# Altium project wiring_board.PrjPcb
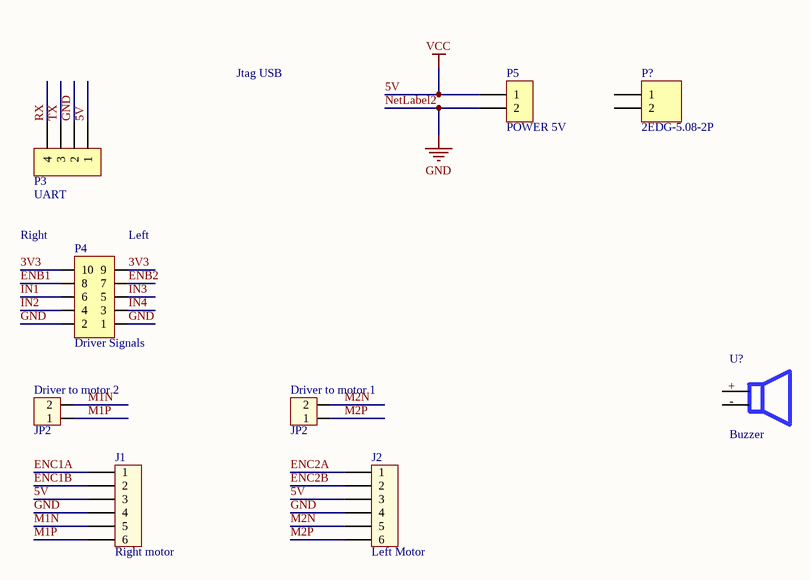
[diagram p0: wiring_board.SchDoc]
1 sheet, 9 parts. Net scope: global (net labels, ports and power ports of the same name join across sheets).
Board file: wiring_board.PcbDoc

## Sheet wiring_board.SchDoc
size A

### Parts
Driver_to_motor_1  JP2  [CON2]
Driver_to_motor_2  JP2  [CON2]
J1  Right motor  [XH 6PIN 2.54]
J2  Left Motor  [XH 6PIN 2.54]
P3  UART  [HEADER_4_MALE]
P4  Driver Signals  [HEADER_5x2_MALE_2.54]
P5  POWER 5V  [HEADER_2_MALE]
P?  2EDG-5.08-2P  [Terminal block 2Pin 5.08]
U?  Buzzer  [BUZZER D12]

### Nets
5V: J1.3 J2.3 P3.1 P5.1  [also labelled VCC]
GND: J1.4 J2.4 P3.2 P4.1 P4.2 P5.2  [also labelled NetLabel2]
3V3: P4.9 P4.10
ENB1: P4.8
ENB2: P4.7
ENC1A: J1.1
ENC1B: J1.2
ENC2A: J2.1
ENC2B: J2.2
IN1: P4.6
IN2: P4.4
IN3: P4.5
IN4: P4.3
M1N: Driver_to_motor_2.2 J1.5
M1P: Driver_to_motor_2.1 J1.6
M2N: Driver_to_motor_1.2 J2.5
M2P: Driver_to_motor_1.1 J2.6
RX: P3.4
TX: P3.3

Not connected (* = marked no-connect by the designer): P? 1 2; U? 1(+) 2(-)

### Notes on the sheet
- Jtag USB
- (near P4) Right
- (near P4) Left

### Library data of the parts
Driver_to_motor_1 Driver_to_motor_2 = Con2: Connector 2; Value: Connector 2
J1 J2 = XH_2.54_6P: 4P, 2.54mm, 250V, 3A; Manufacturer: *; Part Number: *; Package: *; Ex Supplier: *; Ex Price: *; VN Supplier: *; VN Price: *; Value: *; Tolerance: *; Voltage/Wattage: *
P3 = Header_4_Male_2.54: 2.54mm 4x1 Single Male Pin Header; Manufacturer: Molex; Ex Price: 0.34; VN Price: 2500; Value: Header 4; Voltage/Wattage: 500V/4A; Part Number: 22-28-8041; Ex Supplier: https://www.mouser.vn/ProductDetail/Molex/22-28-8041?qs=%2Fha2pyFadui70NFvRAbn%252BC%2FfLTOVR6y0%2FPOCLhktbL8%3D; VN Supplier: http://tme.vn/Product.aspx?id=518
P4 = Header_5x2_Male_2.54: 2.54mm 5x2 Male Pin Header; Manufacturer: MINTRON; Part Number: MTP125-1205S1; Ex Price: 0.053; VN Price: 1700; Voltage/Wattage: 500V/4A; Ex Supplier: https://lcsc.com/product-detail/Pin-Header-Female-Header_MINTRON-MTP125-1205S1_C358694.html; VN Supplier: https://www.thegioiic.com/products/hang-rao-duc-doi-2-54mm-80-chan-2-hang-cao-11-6mm-xuyen-lo
P5 = Header_2_Male_2.54: 2.54mm 2x1 Single Male Pin Header; Manufacturer: Molex; VN Price: 200; Value: Header 2; Voltage/Wattage: 500V/4A; Ex Price: 0.096; VN Supplier: http://www.tme.vn/Product.aspx?id=518#page=pro_info; Ex Supplier: https://www.mouser.vn/ProductDetail/Molex/22-28-5023?qs=sGAEpiMZZMs%252BGHln7q6pm0R%252BIqgWC%252BQx%252BZP1khnW%252BIc%3D; Part Number: 22-28-5023
P? = 2EDG-5.08-2P: Pluggable Terminal Blocks WR-TBL PCB Model 311 2Pin 5.08mm Cls Vtcl; Manufacturer: Wurth Elektronik; Part Number: 691311500102; Ex Price: 0.34; VN Price: 3000; Voltage/Wattage: 300V - 20A; Ex Supplier: https://www.mouser.vn/ProductDetail/Wurth-Elektronik/691311500102?qs=%2Fha2pyFaduhL3k1l8cITJNpuw5ctJaUN5kmE3D1IKhn6PrUHnsDfng%3D%3D; VN Supplier: https://thegioiic.com/products/terminal-block-2-chan-5-08-chan-thang-2edg-5-08-2p
U? = Buzzer: DIP Buzzer 12x9mm; Manufaceturer: OEM; VN Price: 3000; VN Supplier: https://thegioiic.com/products/1209-dip-buzzer-12x9mm